# Altium schematic sheet input2.SchDoc
size A3
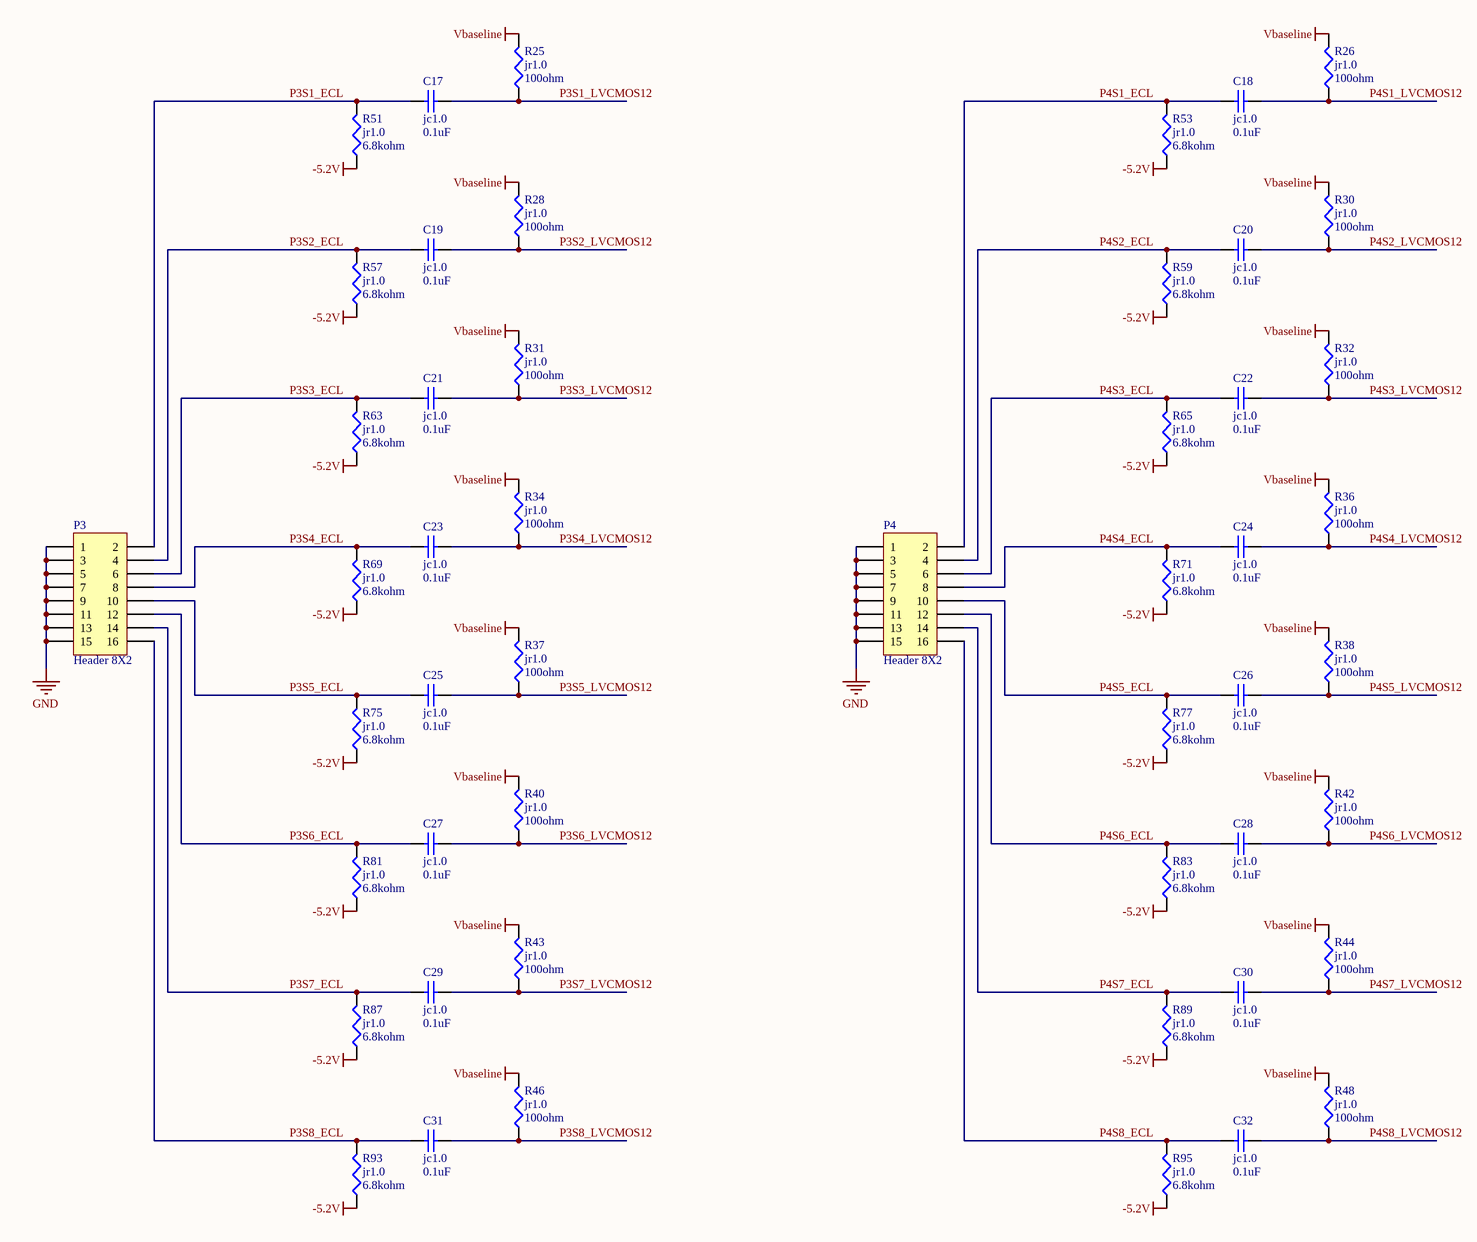
[diagram p0: input2.SchDoc]

## Parts
C17  jc1.0  value 0.1uF  [0402]
C18  jc1.0  value 0.1uF  [0402]
C19  jc1.0  value 0.1uF  [0402]
C20  jc1.0  value 0.1uF  [0402]
C21  jc1.0  value 0.1uF  [0402]
C22  jc1.0  value 0.1uF  [0402]
C23  jc1.0  value 0.1uF  [0402]
C24  jc1.0  value 0.1uF  [0402]
C25  jc1.0  value 0.1uF  [0402]
C26  jc1.0  value 0.1uF  [0402]
C27  jc1.0  value 0.1uF  [0402]
C28  jc1.0  value 0.1uF  [0402]
C29  jc1.0  value 0.1uF  [0402]
C30  jc1.0  value 0.1uF  [0402]
C31  jc1.0  value 0.1uF  [0402]
C32  jc1.0  value 0.1uF  [0402]
P3  Header 8X2  [HDR2X8]
P4  Header 8X2  [HDR2X8]
R25  jr1.0  value 100ohm  [0402]
R26  jr1.0  value 100ohm  [0402]
R28  jr1.0  value 100ohm  [0402]
R30  jr1.0  value 100ohm  [0402]
R31  jr1.0  value 100ohm  [0402]
R32  jr1.0  value 100ohm  [0402]
R34  jr1.0  value 100ohm  [0402]
R36  jr1.0  value 100ohm  [0402]
R37  jr1.0  value 100ohm  [0402]
R38  jr1.0  value 100ohm  [0402]
R40  jr1.0  value 100ohm  [0402]
R42  jr1.0  value 100ohm  [0402]
R43  jr1.0  value 100ohm  [0402]
R44  jr1.0  value 100ohm  [0402]
R46  jr1.0  value 100ohm  [0402]
R48  jr1.0  value 100ohm  [0402]
R51  jr1.0  value 6.8kohm  [0402]
R53  jr1.0  value 6.8kohm  [0402]
R57  jr1.0  value 6.8kohm  [0402]
R59  jr1.0  value 6.8kohm  [0402]
R63  jr1.0  value 6.8kohm  [0402]
R65  jr1.0  value 6.8kohm  [0402]
R69  jr1.0  value 6.8kohm  [0402]
R71  jr1.0  value 6.8kohm  [0402]
R75  jr1.0  value 6.8kohm  [0402]
R77  jr1.0  value 6.8kohm  [0402]
R81  jr1.0  value 6.8kohm  [0402]
R83  jr1.0  value 6.8kohm  [0402]
R87  jr1.0  value 6.8kohm  [0402]
R89  jr1.0  value 6.8kohm  [0402]
R93  jr1.0  value 6.8kohm  [0402]
R95  jr1.0  value 6.8kohm  [0402]

## Nets
-5.2V: R51.1 R53.1 R57.1 R59.1 R63.1 R65.1 R69.1 R71.1 R75.1 R77.1 R81.1 R83.1 R87.1 R89.1 R93.1 R95.1
GND: P3.1 P3.3 P3.5 P3.7 P3.9 P3.11 P3.13 P3.15 P4.1 P4.3 P4.5 P4.7 P4.9 P4.11 P4.13 P4.15
Vbaseline: R25.2 R26.2 R28.2 R30.2 R31.2 R32.2 R34.2 R36.2 R37.2 R38.2 R40.2 R42.2 R43.2 R44.2 R46.2 R48.2
P3S1_ECL: C17.1 P3.2 R51.2
P3S1_LVCMOS12: C17.2 R25.1
P3S2_ECL: C19.1 P3.4 R57.2
P3S2_LVCMOS12: C19.2 R28.1
P3S3_ECL: C21.1 P3.6 R63.2
P3S3_LVCMOS12: C21.2 R31.1
P3S4_ECL: C23.1 P3.8 R69.2
P3S4_LVCMOS12: C23.2 R34.1
P3S5_ECL: C25.1 P3.10 R75.2
P3S5_LVCMOS12: C25.2 R37.1
P3S6_ECL: C27.1 P3.12 R81.2
P3S6_LVCMOS12: C27.2 R40.1
P3S7_ECL: C29.1 P3.14 R87.2
P3S7_LVCMOS12: C29.2 R43.1
P3S8_ECL: C31.1 P3.16 R93.2
P3S8_LVCMOS12: C31.2 R46.1
P4S1_ECL: C18.1 P4.2 R53.2
P4S1_LVCMOS12: C18.2 R26.1
P4S2_ECL: C20.1 P4.4 R59.2
P4S2_LVCMOS12: C20.2 R30.1
P4S3_ECL: C22.1 P4.6 R65.2
P4S3_LVCMOS12: C22.2 R32.1
P4S4_ECL: C24.1 P4.8 R71.2
P4S4_LVCMOS12: C24.2 R36.1
P4S5_ECL: C26.1 P4.10 R77.2
P4S5_LVCMOS12: C26.2 R38.1
P4S6_ECL: C28.1 P4.12 R83.2
P4S6_LVCMOS12: C28.2 R42.1
P4S7_ECL: C30.1 P4.14 R89.2
P4S7_LVCMOS12: C30.2 R44.1
P4S8_ECL: C32.1 P4.16 R95.2
P4S8_LVCMOS12: C32.2 R48.1

## Library data of the parts
C17-C32 = Cap: Capacitor; Published: 8-Jun-2000; LatestRevisionDate: 17-Jul-2002; LatestRevisionNote: Re-released for DXP Platform.; PackageReference: RAD-0.3; Publisher: Altium Limited
P3 P4 = Header 8X2: Header, 8-Pin, Dual row; LatestRevisionDate: 17-Jul-2002; LatestRevisionNote: Re-released for DXP Platform.; Publisher: Altium Limited
R25 R26 R28 R30-R32 R34 R36-R38 R40 R42-R44 R46 R48 R51 R53 R57 R59 R63 R65 R69 R71 R75 R77 R81 R83 R87 R89 R93 R95 = Res: Resistor; Published: 8-Jun-2000; LatestRevisionDate: 04-Mar-2005; LatestRevisionNote: PCB Footprint replaced.; PackageReference: J1-0603; Publisher: Altium Limited